# Altium project PCB_VFD.PrjPcb
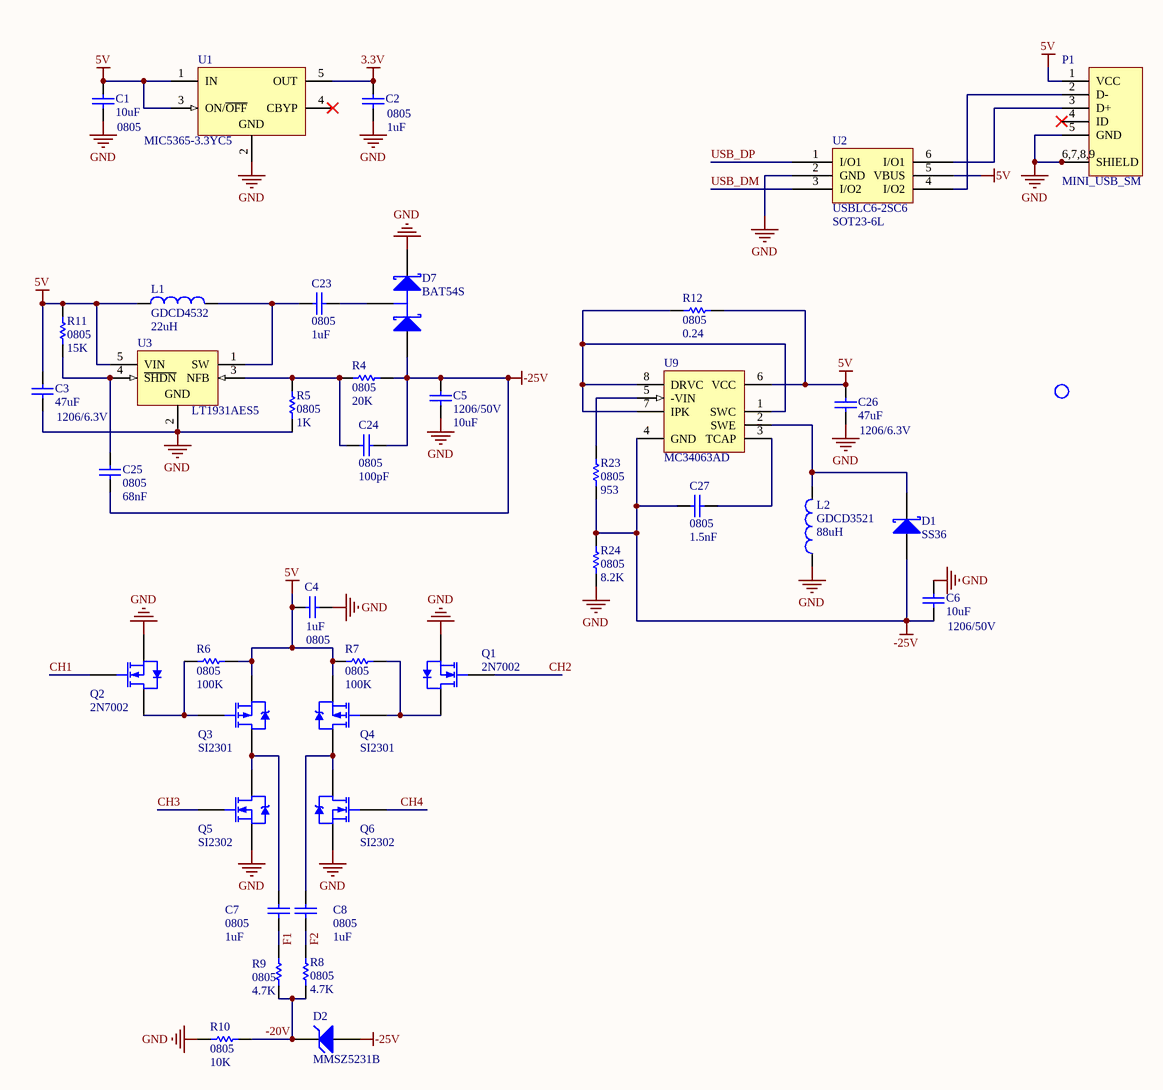
[diagram p0: vfd_power.SchDoc]
3 sheets, 84 parts. Net scope: global (net labels, ports and power ports of the same name join across sheets).
Board file: VFD.PcbDoc
Sheets:
  vfd_power.SchDoc
  vfd_pt6315.SchDoc
  vfd_mcu.SchDoc

## Sheet vfd_power.SchDoc: VFD Round Clock - Power Management
size A3

### Parts
C1  0805  value 10uF  [6-0805_N]
C2  0805  value 1uF  [6-0805_N]
C3  1206/6.3V  value 47uF  [C1206]
C4  0805  value 1uF  [6-0805_N]
C5  1206/50V  value 10uF  [C1206]
C6  1206/50V  value 10uF  [C1206]
C7  0805  value 1uF  [6-0805_N]
C8  0805  value 1uF  [6-0805_N]
C23  0805  value 1uF  [6-0805_N]
C24  0805  value 100pF  [6-0805_N]
C25  0805  value 68nF  [6-0805_N]
C26  1206/6.3V  value 47uF  [C1206]
C27  0805  value 1.5nF  [6-0805_N]
D1  SS36  [SMA]
D2  MMSZ5231B  [SOD-123]
D7  BAT54S  [SOT23_N]
G1  ESD Label  [ESD]  (value not drawn)
L1  GDCD4532  value 22uH  [GDCD4532]
L2  GDCD3521  value 88uH  [GDCD3521]
P1  MINI_USB_SM  [USB/SM0.8-6H5]
Q1  2N7002  [SOT-23]
Q2  2N7002  [SOT-23]
Q3  SI2301  [SOT-23]
Q4  SI2301  [SOT-23]
Q5  SI2302  [SOT-23]
Q6  SI2302  [SOT-23]
R4  0805  value 20K  [6-0805_N]
R5  0805  value 1K  [6-0805_N]
R6  0805  value 100K  [6-0805_N]
R7  0805  value 100K  [6-0805_N]
R8  0805  value 4.7K  [6-0805_N]
R9  0805  value 4.7K  [6-0805_N]
R10  0805  value 10K  [6-0805_N]
R11  0805  value 15K  [6-0805_N]
R12  0805  value 0.24  [6-0805_N]
R23  0805  value 953  [6-0805_N]
R24  0805  value 8.2K  [6-0805_N]
U1  MIC5365-3.3YC5  [SC70-5_N]
U2  USBLC6-2SC6  PackageReference: SOT23-6L  [SOT-23_A_N]
U3  LT1931AES5  [S5-T_N]
U9  MC34063AD  [751-02_N]

### Nets
3.3V: C2.2 U1.5(OUT)
5V: C1.2 C3.2 C4.2 C26.2 L1.1 P1.1(VCC) Q3.2(S) Q4.2(S) R6.1 R7.2 R11.1 R12.1 U1.1(IN) U1.3(ON/~{OFF}) U2.5(VBUS) U3.5(VIN) U9.6(VCC)
-25V: C5.1 C6.1 C24.1 C25.2 C27.2 D1.1(A) D2.1(A) D7.1(A) R4.1 R23.2 R24.1 U9.4(GND)
GND: C1.1 C2.1 C3.1 C4.1 C5.2 C6.2 C26.1 D7.2(K) L2.1 P1.5(GND) P1.6(SHIELD) P1.7(SHIELD) P1.8(SHIELD) P1.9(SHIELD) Q1.2(S) Q2.2(S) Q5.2(S) Q6.2(S) R5.1 R10.1 R24.2 U1.2(GND) U2.2(GND) U3.2(GND)
-20V: D2.2(K) R8.2 R9.2 R10.2
CH1: Q2.1(G)
CH2: Q1.1(G)
CH3: Q5.1(G)
CH4: Q6.1(G)
F1: C7.1 R9.1
F2: C8.1 R8.1
USB_DM: U2.3(I/O2)
USB_DP: U2.1(I/O1)
NetC7_2: C7.2 Q3.3(D) Q5.3(D)
NetC8_2: C8.2 Q4.3(D) Q6.3(D)
NetC23_1: C23.1 D7.3(C)
NetC23_2: C23.2 L1.2 U3.1(SW)
NetC24_2: C24.2 R4.2 R5.2 U3.3(NFB)
NetC25_1: C25.1 R11.2 U3.4(~{SHDN})
NetC27_1: C27.1 U9.3(TCAP)
NetD1_2: D1.2(K) L2.2 U9.2(SWE)
NetP1_2: P1.2(D-) U2.4(I/O2)
NetP1_3: P1.3(D+) U2.6(I/O1)
NetQ1_3: Q1.3(D) Q4.1(G) R7.1
NetQ2_3: Q2.3(D) Q3.1(G) R6.2
NetR12_2: R12.2 U9.1(SWC) U9.7(IPK) U9.8(DRVC)
NetR23_1: R23.1 U9.5(-VIN)

Not connected (* = marked no-connect by the designer): P1 4(ID)*; U1 4(CBYP)*

### Notes on the sheet
- (in symbol MINI_USB_SM) 6,7,8,9

### Library data of the parts
C1-C8 C23-C27 = Cap: Capacitor; Published: 8-Jun-2000; Publisher: Altium Limited
  C1-C3 C5 C6 C23-C27: LatestRevisionDate: 17-Jul-2002; LatestRevisionNote: Re-released for DXP Platform.; PackageReference: RAD-0.3; PackageDescription: Radial Cap, Thru-Hole; 2 Leads; 0.3 in Pin Spacing
  C4 C7 C8: Revision: July-2002: Re-released for DXP Platform.
D1 = D Schottky: Schottky Diode; Published: 8-Jun-2000; LatestRevisionDate: 17-Jul-2002; LatestRevisionNote: Re-released for DXP Platform.; PackageReference: SMB; Publisher: Altium Limited; PackageDescription: DO-214-AA/SMB; 2 C-Bend Leads; Body 5.3 x 3.6 mm, inc. leads (LxW); Code_JEDEC: DO-214-AA
D2 = D Zener: Zener Diode; Published: 8-Jun-2000; LatestRevisionDate: 17-Jul-2002; LatestRevisionNote: Re-released for DXP Platform.; PackageReference: DIODE-0.7; Publisher: Altium Limited; PackageDescription: Diode, Thru-Hole; 2 Leads; 0.7 in Pin Spacing
D7 = BAT54S: Schottky Barrier Double Diode; Published: 17-Sep-2003; LatestRevisionDate: 12-Dec-2006; LatestRevisionNote: IPC-7351 Footprint Added.; DatasheetVersion: 4-Mar-2002; PackageVersion: May-1999; PackageReference: SOT23; Publisher: Altium Limited; PackageDescription: 3-Pin SOT-23 Package 0.95 mm Pitch, 2.3 mm Lead Span; ComponentLink1Description: Manufacturer Link; ComponentLink1URL: http://www.semiconductors.philips.com/; ComponentLink2Description: Datasheet; ComponentLink2URL: http://www.semiconductors.philips.com/acrobat/datasheets/BAT54_SERIES_4.pdf
G1 = g固定过孔
L1 L2 = Inductor: Code_IEC: 1005; Published: 8-Jun-2000; LatestRevisionDate: 17-Jul-2002; LatestRevisionNote: Re-released for DXP Platform.; PackageReference: 0402-A; Publisher: Altium Limited; Code_JEITA: 0402
Q1 Q2 = 2N7002: N-channel Enhancement Mode Field-effect Transistor; Published: 17-Sep-2003; LatestRevisionDate: 12-Dec-2006; LatestRevisionNote: IPC-7351 Footprint Added.; DatasheetVersion: 27-Jul-2000; PackageVersion: May-1999; PackageReference: SOT23; Publisher: Altium Limited; PackageDescription: 3-Pin SOT-23 Package 0.95 mm Pitch, 2.3 mm Lead Span; ComponentLink1Description: Manufacturer Link; ComponentLink1URL: http://www.semiconductors.philips.com/; ComponentLink2Description: Datasheet; ComponentLink2URL: http://www.semiconductors.philips.com/acrobat/datasheets/2N7002_4.pdf
Q3 Q4 = PMOS-2: P-Channel Power MOSFET; Note: Pin 4 not drawn and electrically connected to Pin 2.; Published: 8-Jun-2000; LatestRevisionDate: 17-Jul-2002; LatestRevisionNote: Re-released for DXP Platform.; DatasheetVersion: PD-9.390D; PackageVersion: Feb-1997; PackageReference: TO-220AB; Publisher: Altium Limited; PackageDescription: TO, Thru-Hole, Vertical, Heatsink Mounted; 3 In-Line Leads; Pitch 2.54 mm; ComponentLink1Description: Manufacturer Link; ComponentLink1URL: http://www.irf.com/
Q5 Q6 = NMOS-2: N-Channel Power MOSFET; Note: Pin 2 is electrically connected to pin 4.; Published: 8-Jun-2000; LatestRevisionDate: 17-Jul-2002; LatestRevisionNote: Re-released for DXP Platform.; DatasheetVersion: PD-9.814; PackageVersion: Feb-1997; PackageReference: TO-220AB; Publisher: Altium Limited; PackageDescription: TO, Thru-Hole, Vertical, Heatsink Mounted; 3 In-Line Leads; Pitch 2.54 mm; ComponentLink1Description: Manufacturer Link; ComponentLink1URL: http://www.irf.com/
R4-R12 R23 R24 = Res1: Resistor; Published: 8-Jun-2000; LatestRevisionDate: 17-Jul-2002; LatestRevisionNote: Re-released for DXP Platform.; PackageReference: AXIAL-0.3; Publisher: Altium Limited
U1 = LP2985AIM5-3.3/NOPB: Micropower 150 mA Low-Noise Ultra Low-Dropout Regulator, 5-pin SOT-323, Pb-Free; Manufacturer: National Semiconductor; PackageTopMarking: L0RA*XTT; PowerWise: N; CompType: LDO IC; Published: 1-Mar-2010; DatasheetVersion: Jul-2007; PackageVersion: revD, Aug-2008; PackageReference: MF05A; Publisher: Altium Limited; PackageDescription: Molded SOT-323, .115 x .063 x .040 in Body, 5 Lead, .0375 in Pitch; Supplier 1: Digi-Key; Supplier Part Number 1: MIC5365-3.3YC5; Supplier 2: Digi-Key; Supplier 3: Digi-Key; Supplier 4: Farnell; PartNumber: MIC5365-3.3YC5; RoHS: Y; PinCount: 5; ComponentLink1Description: LP2985 Datasheet; ComponentLink1URL: http://www.national.com/ds/LP/LP2985.pdf; ComponentLink2Description: MIC5365-3.3YC5; ComponentLink2URL: http://www.national.com/pf/LP/LP2985.html; ComponentLink3Description: MF05A Package Page
U2 = Component_1
U3 = LT1931AES5: 2.2MHz Inverting Current Mode DC/DC Converter; Note: 1639; Published: 6-Jun-2005; LatestRevisionDate: 29-May-2009; LatestRevisionNote: IPC-7351 Footprint Added.; DatasheetVersion: Jun-2001; PackageVersion: 2005; PackageReference: S5-T; Publisher: Altium Limited; PackageDescription: 5-Pin SOT-23 Package 0.95 mm Pitch, 2.8 mm Lead Span; Code_IPC: SOT23-5; ComponentLink1Description: Manufacturer Link; ComponentLink1URL: http://www.linear.com/; ComponentLink2Description: Datasheet; ComponentLink2URL: http://www.linear.com/pc/downloadDocument.do?navId=H0,C1,C1003,C1042,P1863,D3921
U9 = MC34063AD: DC-to-DC Converter Control Circuit; Published: 17-Jul-2002; LatestRevisionDate: 13-Apr-2006; LatestRevisionNote: IPC-7351 Footprint Added.; DatasheetVersion: 1988; PackageReference: 751-02; Publisher: Altium Limited; PackageDescription: 8-Pin Small Outline Integrated Circuit 1.27 mm Pitch; Code_JEDEC: MS-012-AA; Code_IPC: SOIC127P600-8; ComponentLink1Description: Manufacturer Link; ComponentLink1URL: http://www.onsemi.com/site/products/taxonomy/0,4438,503,00.html; ComponentLink2Description: Datasheet; ComponentLink2URL: http://www.onsemi.com/pub/Collateral/MC34063A-D.PDF

## Sheet vfd_pt6315.SchDoc
size A3
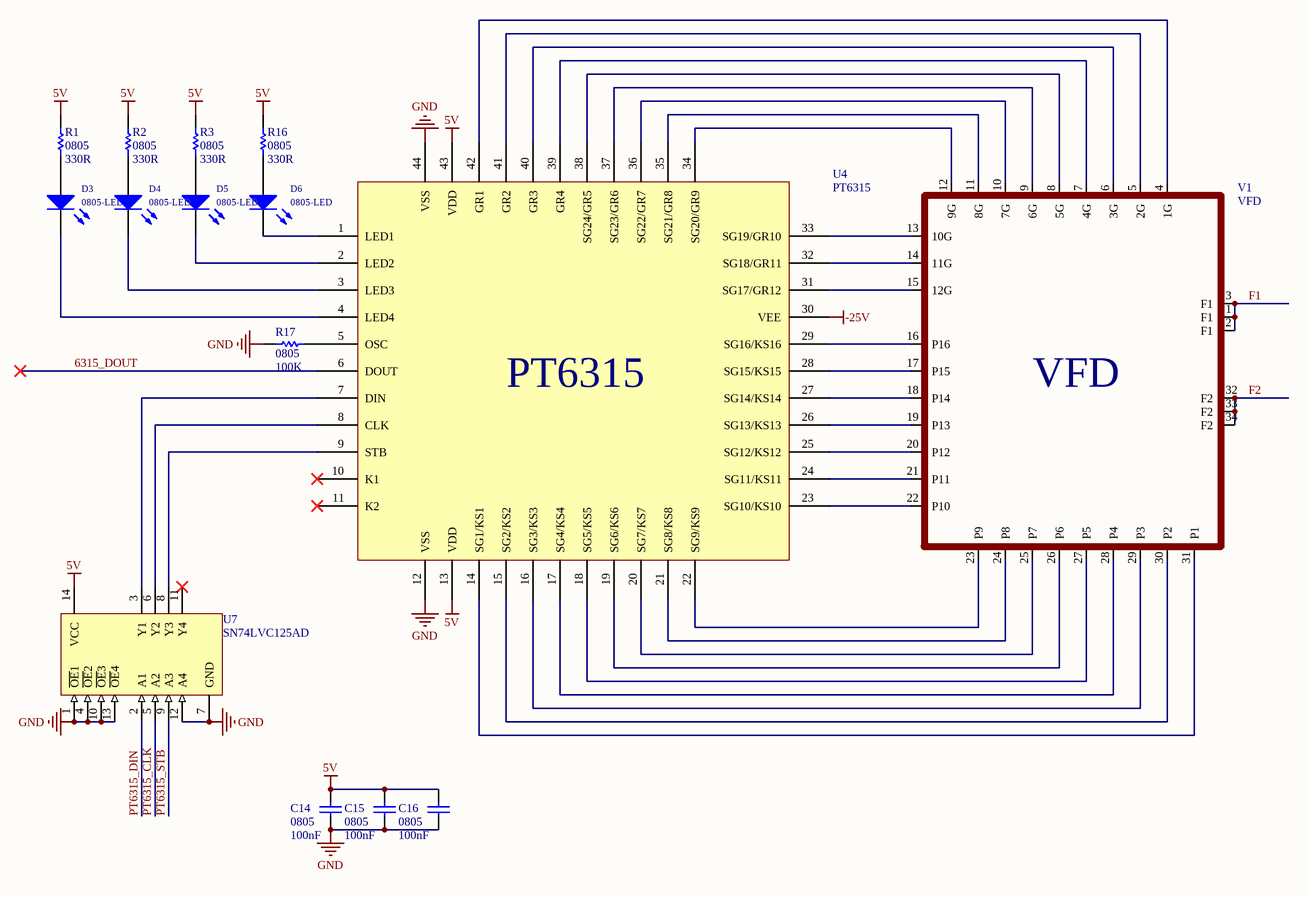
[diagram p1: vfd_pt6315.SchDoc]

### Parts
C14  0805  value 100nF  [6-0805_N]
C15  0805  value 100nF  [6-0805_N]
C16  0805  value 100nF  [6-0805_N]
D3  0805-LED  [SMD _LED]
D4  0805-LED  [SMD _LED]
D5  0805-LED  [SMD _LED]
D6  0805-LED  [SMD _LED]
R1  0805  value 330R  [6-0805_N]
R2  0805  value 330R  [6-0805_N]
R3  0805  value 330R  [6-0805_N]
R16  0805  value 330R  [6-0805_N]
R17  0805  value 100K  [6-0805_N]
U4  PT6315  [LQFP44_10X10X08P]
U7  SN74LVC125AD  [D014_N]
V1  VFD  [VFD48-1202FN]

### Nets
5V: C14.2 C15.2 C16.2 R1.2 R2.2 R3.2 R16.2 U4.13(VDD) U4.43(VDD) U7.14(VCC)
-25V: U4.30(VEE)
GND: C14.1 C15.1 C16.1 R17.1 U4.12(VSS) U4.44(VSS) U7.1(~{OE}1) U7.4(~{OE}2) U7.7(GND) U7.10(~{OE}3) U7.12(A4) U7.13(~{OE}4)
6315_DOUT: U4.6(DOUT)
F1: V1.1(F1) V1.2(F1) V1.3(F1)
F2: V1.32(F2) V1.33(F2) V1.34(F2)
PT6315_CLK: U7.5(A2)
PT6315_DIN: U7.2(A1)
PT6315_STB: U7.9(A3)
NetD3_1: D3.1(A) R1.1
NetD3_2: D3.2(K) U4.4(LED4)
NetD4_1: D4.1(A) R2.1
NetD4_2: D4.2(K) U4.3(LED3)
NetD5_1: D5.1(A) R3.1
NetD5_2: D5.2(K) U4.2(LED2)
NetD6_1: D6.1(A) R16.1
NetD6_2: D6.2(K) U4.1(LED1)
NetR17_2: R17.2 U4.5(OSC)
NetU4_7: U4.7(DIN) U7.3(Y1)
NetU4_8: U4.8(CLK) U7.6(Y2)
NetU4_9: U4.9(STB) U7.8(Y3)
NetU4_14: U4.14(SG1/KS1) V1.31(P1)
NetU4_15: U4.15(SG2/KS2) V1.30(P2)
NetU4_16: U4.16(SG3/KS3) V1.29(P3)
NetU4_17: U4.17(SG4/KS4) V1.28(P4)
NetU4_18: U4.18(SG5/KS5) V1.27(P5)
NetU4_19: U4.19(SG6/KS6) V1.26(P6)
NetU4_20: U4.20(SG7/KS7) V1.25(P7)
NetU4_21: U4.21(SG8/KS8) V1.24(P8)
NetU4_22: U4.22(SG9/KS9) V1.23(P9)
NetU4_23: U4.23(SG10/KS10) V1.22(P10)
NetU4_24: U4.24(SG11/KS11) V1.21(P11)
NetU4_25: U4.25(SG12/KS12) V1.20(P12)
NetU4_26: U4.26(SG13/KS13) V1.19(P13)
NetU4_27: U4.27(SG14/KS14) V1.18(P14)
NetU4_28: U4.28(SG15/KS15) V1.17(P15)
NetU4_29: U4.29(SG16/KS16) V1.16(P16)
NetU4_31: U4.31(SG17/GR12) V1.15(12G)
NetU4_32: U4.32(SG18/GR11) V1.14(11G)
NetU4_33: U4.33(SG19/GR10) V1.13(10G)
NetU4_34: U4.34(SG20/GR9) V1.12(9G)
NetU4_35: U4.35(SG21/GR8) V1.11(8G)
NetU4_36: U4.36(SG22/GR7) V1.10(7G)
NetU4_37: U4.37(SG23/GR6) V1.9(6G)
NetU4_38: U4.38(SG24/GR5) V1.8(5G)
NetU4_39: U4.39(GR4) V1.7(4G)
NetU4_40: U4.40(GR3) V1.6(3G)
NetU4_41: U4.41(GR2) V1.5(2G)
NetU4_42: U4.42(GR1) V1.4(1G)

Not connected (* = marked no-connect by the designer): U4 10(K1)* 11(K2)*; U7 11(Y4)*

### Library data of the parts
C14-C16 = CAP: Capacitor; Published: 8-Jun-2000; Revision: July-2002: Re-released for DXP Platform.; Publisher: Altium Limited
D3-D6 = HSMX-C670_1: Typical RED GaAs SMD LED Agilent make; AEMS Code: 2610081; Revision: July-2002: Re-released for DXP Platform.
R1-R3 R16 R17 = Res1: Resistor; Published: 8-Jun-2000; LatestRevisionDate: 17-Jul-2002; LatestRevisionNote: Re-released for DXP Platform.; PackageReference: AXIAL-0.3; Publisher: Altium Limited
U7 = SN74LVC125AD: Quadruple Bus Buffer Gate with 3-State Outputs; Published: 8-Jun-2000; LatestRevisionDate: 13-Apr-2006; LatestRevisionNote: IPC-7351 Footprint Added.; DatasheetVersion: Jun-1998; PackageVersion: Jan-1998; PackageReference: D014; Publisher: Altium Limited; PackageDescription: 14-Pin Small Outline Integrated Circuit 1.27 mm Pitch; Code_IPC: SOIC127P600-14; ComponentLink1Description: Manufacturer Link; ComponentLink1URL: http://www.ti.com/; ComponentLink2Description: Datasheet; ComponentLink2URL: http://www-s.ti.com/sc/ds/sn74lvc125a.pdf
V1 = VFD48-1202FN

## Sheet vfd_mcu.SchDoc
size A3
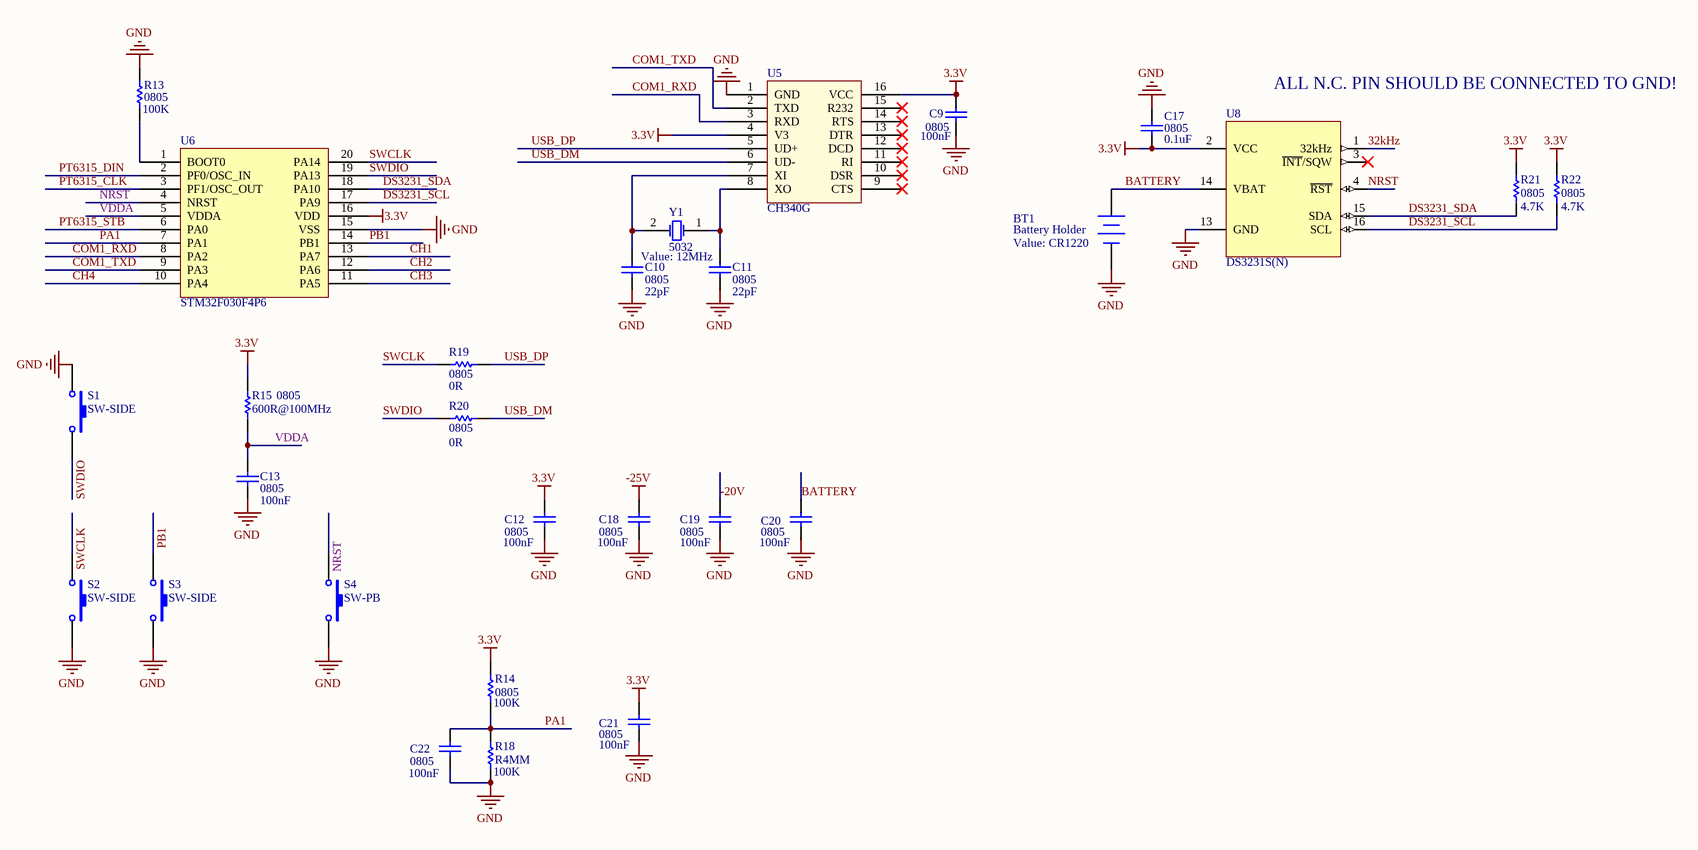
[diagram p2: vfd_mcu.SchDoc]

### Parts
BT1  Battery Holder  value CR1220  [BAT]
C9  0805  value 100nF  [6-0805_N]
C10  0805  value 22pF  [6-0805_N]
C11  0805  value 22pF  [6-0805_N]
C12  0805  value 100nF  [6-0805_N]
C13  0805  value 100nF  [6-0805_N]
C17  0805  value 0.1uF  [6-0805_N]
C18  0805  value 100nF  [6-0805_N]
C19  0805  value 100nF  [6-0805_N]
C20  0805  value 100nF  [6-0805_N]
C21  0805  value 100nF  [6-0805_N]
C22  0805  value 100nF  [6-0805_N]
R13  0805  value 100K  [6-0805_N]
R14  0805  value 100K  [6-0805_N]
R15  0805  value 600R@100MHz  [6-0805_N]
R18  R4MM  value 100K  [R4MM]
R19  0805  value 0R  [6-0805_N]
R20  0805  value 0R  [6-0805_N]
R21  0805  value 4.7K  [6-0805_N]
R22  0805  value 4.7K  [6-0805_N]
S1  SW-SIDE  [SW_SIDE]
S2  SW-SIDE  [SW_SIDE]
S3  SW-SIDE  [SW_SIDE]
S4  SW-PB  [aj3X6]
U5  CH340G  [SOP-16_N]
U6  STM32F030F4P6  [TSSOP20]
U8  DS3231S(N)  [WSO16_N]
Y1  5032  value 12MHz  [4SMX]

### Nets
3.3V: C9.2 C12.2 C17.1 C21.2 R14.1 R15.1 R21.2 R22.2 U5.4(V3) U5.16(VCC) U6.16(VDD) U8.2(VCC)
-25V: C18.2
GND: BT1.2(-) C9.1 C10.1 C11.1 C12.1 C13.1 C17.2 C18.1 C19.1 C20.1 C21.1 C22.1 R13.1 R18.2 S1.1 S2.2 S3.2 S4.2 U5.1(GND) U6.15(VSS) U8.5(N.C.) U8.6(N.C.) U8.7(N.C.) U8.8(N.C.) U8.9(N.C.) U8.10(N.C.) U8.11(N.C.) U8.12(N.C.) U8.13(GND)
32kHz: U8.1(32kHz)
-20V: C19.2
BATTERY: BT1.1(+) C20.2 U8.14(VBAT)
CH1: U6.13(PA7)
CH2: U6.12(PA6)
CH3: U6.11(PA5)
CH4: U6.10(PA4)
COM1_RXD: U5.3(RXD) U6.8(PA2)
COM1_TXD: U5.2(TXD) U6.9(PA3)
DS3231_SCL: R22.1 U6.17(PA9) U8.16(SCL)
DS3231_SDA: R21.1 U6.18(PA10) U8.15(SDA)
NRST: S4.1 U6.4(NRST) U8.4(~{RST})
PA1: C22.2 R14.2 R18.1 U6.7(PA1)
PB1: S3.1 U6.14(PB1)
PT6315_CLK: U6.3(PF1/OSC_OUT)
PT6315_DIN: U6.2(PF0/OSC_IN)
PT6315_STB: U6.6(PA0)
SWCLK: R19.2 S2.1 U6.20(PA14)
SWDIO: R20.2 S1.2 U6.19(PA13)
USB_DM: R20.1 U5.6(UD-)
USB_DP: R19.1 U5.5(UD+)
VDDA: C13.2 R15.2 U6.5(VDDA)
NetC10_2: C10.2 U5.7(XI) Y1.2(OSC2)
NetC11_2: C11.2 U5.8(XO) Y1.1(OSC1)
NetR13_2: R13.2 U6.1(BOOT0)

Not connected (* = marked no-connect by the designer): U5 9(CTS)* 10(DSR)* 11(RI)* 12(DCD)* 13(DTR)* 14(RTS)* 15(R232)*; U8 3(~{INT}/SQW)*

### Notes on the sheet
- ALL N.C. PIN SHOULD BE CONNECTED TO GND!

### Library data of the parts
BT1 = Battery: Multicell Battery; Published: 24-Mar-1999; LatestRevisionDate: 17-Jul-2002; LatestRevisionNote: Re-released for DXP Platform.; PackageReference: BAT-2; Publisher: Altium Limited; PackageDescription: Battery; 2 Leads
C9 C12 C18-C22 = CAP: Capacitor; Published: 8-Jun-2000; Revision: July-2002: Re-released for DXP Platform.; Publisher: Altium Limited
C10 C11 C13 C17 = Cap: Capacitor; Published: 8-Jun-2000; LatestRevisionDate: 17-Jul-2002; LatestRevisionNote: Re-released for DXP Platform.; PackageReference: RAD-0.3; Publisher: Altium Limited; PackageDescription: Radial Cap, Thru-Hole; 2 Leads; 0.3 in Pin Spacing
R13 R15 R21 R22 = Res1: Resistor; Published: 8-Jun-2000; LatestRevisionDate: 17-Jul-2002; LatestRevisionNote: Re-released for DXP Platform.; PackageReference: AXIAL-0.3; Publisher: Altium Limited
  R15 R21 R22: PackageDescription: Axial Device, Thru-Hole; 2 Leads; 0.3 in Pin Spacing
R14 R18-R20 = res1: Resistor; Fitted: NO; Published: 8-Jun-2000; Revision: July-2002: Re-released for DXP Platform.; Publisher: Altium Limited
S1-S4 = SW-PB: Switch; Published: 24-Mar-1999; LatestRevisionDate: 17-Jul-2002; LatestRevisionNote: Re-released for DXP Platform.; PackageReference: SPST-2; Publisher: Altium Limited; PackageDescription: Switch; 2 Leads
U8 = DS3231
Y1 = XTAL: Crystal Oscillator; Published: 8-Jun-2000; LatestRevisionDate: 17-Jul-2002; LatestRevisionNote: Re-released for DXP Platform.; PackageReference: R38; Publisher: Altium Limited

## Nets that join several sheets
3.3V: vfd_power (C2.2 U1.5), vfd_mcu (12 pins)
5V: vfd_power (17 pins), vfd_pt6315 (10 pins)
-25V: vfd_power (12 pins), vfd_pt6315 (U4.30), vfd_mcu (C18.2)
GND: vfd_power (24 pins), vfd_pt6315 (12 pins), vfd_mcu (29 pins)
-20V: vfd_power (D2.2 R8.2 R9.2 R10.2), vfd_mcu (C19.2)
CH1: vfd_power (Q2.1), vfd_mcu (U6.13)
CH2: vfd_power (Q1.1), vfd_mcu (U6.12)
CH3: vfd_power (Q5.1), vfd_mcu (U6.11)
CH4: vfd_power (Q6.1), vfd_mcu (U6.10)
F1: vfd_power (C7.1 R9.1), vfd_pt6315 (V1.1 V1.2 V1.3)
F2: vfd_power (C8.1 R8.1), vfd_pt6315 (V1.32 V1.33 V1.34)
PT6315_CLK: vfd_pt6315 (U7.5), vfd_mcu (U6.3)
PT6315_DIN: vfd_pt6315 (U7.2), vfd_mcu (U6.2)
PT6315_STB: vfd_pt6315 (U7.9), vfd_mcu (U6.6)
USB_DM: vfd_power (U2.3), vfd_mcu (R20.1 U5.6)
USB_DP: vfd_power (U2.1), vfd_mcu (R19.1 U5.5)